# Altium schematic sheet PressureCurrentSource.SchDoc
size B
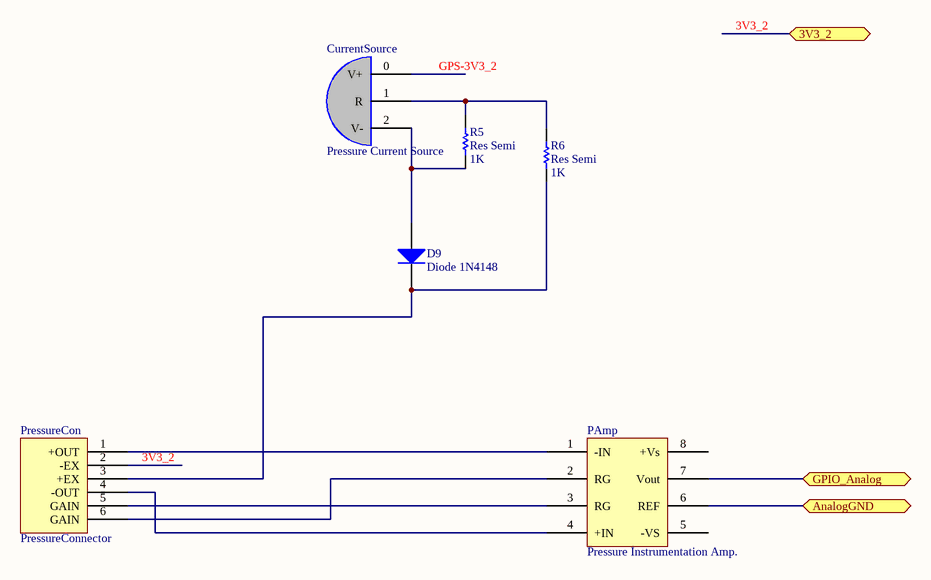
[diagram p0: PressureCurrentSource.SchDoc]

## Parts
CurrentSource  Pressure Current Source  [Pressure Current Source]
D9  Diode 1N4148  [DO-35]
PAmp  Pressure Instrumentation Amp.  [Pressure Instrumentation Amp.]
PressureCon  PressureConnector  [Pressure Connector]
R5  Res Semi  value 1K  [AXIAL-0.5]
R6  Res Semi  value 1K  [AXIAL-0.5]

## Ports
3V3_2 (bidir), AnalogGND (bidir), GPIO_Analog (bidir)

## Nets
3V3_2: PressureCon.2(-EX) ; port 3V3_2
AnalogGND: PAmp.6(REF) ; port AnalogGND
GPIO_Analog: PAmp.7(Vout) ; port GPIO_Analog
GPS-3V3_2: CurrentSource.0(V+)
NetCurrentSource_1: CurrentSource.1(R) R5.2 R6.2
NetCurrentSource_2: CurrentSource.2(V-) D9.1(A) R5.1
NetD9_2: D9.2(K) PressureCon.3(+EX) R6.1
NetPAmp_1: PAmp.1(-IN) PressureCon.1(+OUT)
NetPAmp_2: PAmp.2(RG) PressureCon.6(GAIN)
NetPAmp_3: PAmp.3(RG) PressureCon.5(GAIN)
NetPAmp_4: PAmp.4(+IN) PressureCon.4(-OUT)

Not connected (* = marked no-connect by the designer): PAmp 5(-VS) 8(+Vs)

## Library data of the parts
D9 = Diode 1N4148: High Conductance Fast Diode; Published: 8-Jun-2000; LatestRevisionDate: 17-Jul-2002; LatestRevisionNote: Re-released for DXP Platform.; DatasheetVersion: 1997; PackageReference: DO-35; Publisher: Altium Limited; PackageDescription: Diode, Axial; Body 3.8 x 1.9 mm (LxDia. max), Lead Dia. 0.53 mm (max); Code_JEDEC: DO-204-AH; ComponentLink1Description: Manufacturer Link; ComponentLink1URL: http://www.fairchildsemi.com/; ComponentLink2Description: Datasheet; ComponentLink2URL: http://www.fairchildsemi.com/ds/1N%2F1N4148.pdf
PressureCon = PressureConnector: Molex 70553-0005
R5 R6 = Res Semi: Semiconductor Resistor; Published: 8-Jun-2000; LatestRevisionDate: 17-Jul-2002; LatestRevisionNote: Re-released for DXP Platform.; PackageReference: AXIAL-0.5; Publisher: Altium Limited; PackageDescription: Axial Device, Thru-Hole; 2 Leads; 0.5 in Pin Spacing